# Altium schematic sheet CH32H417MEU6-R0.SchDoc
size 457 x 287 mm; SheetNumber: 0; SheetTotal: 0
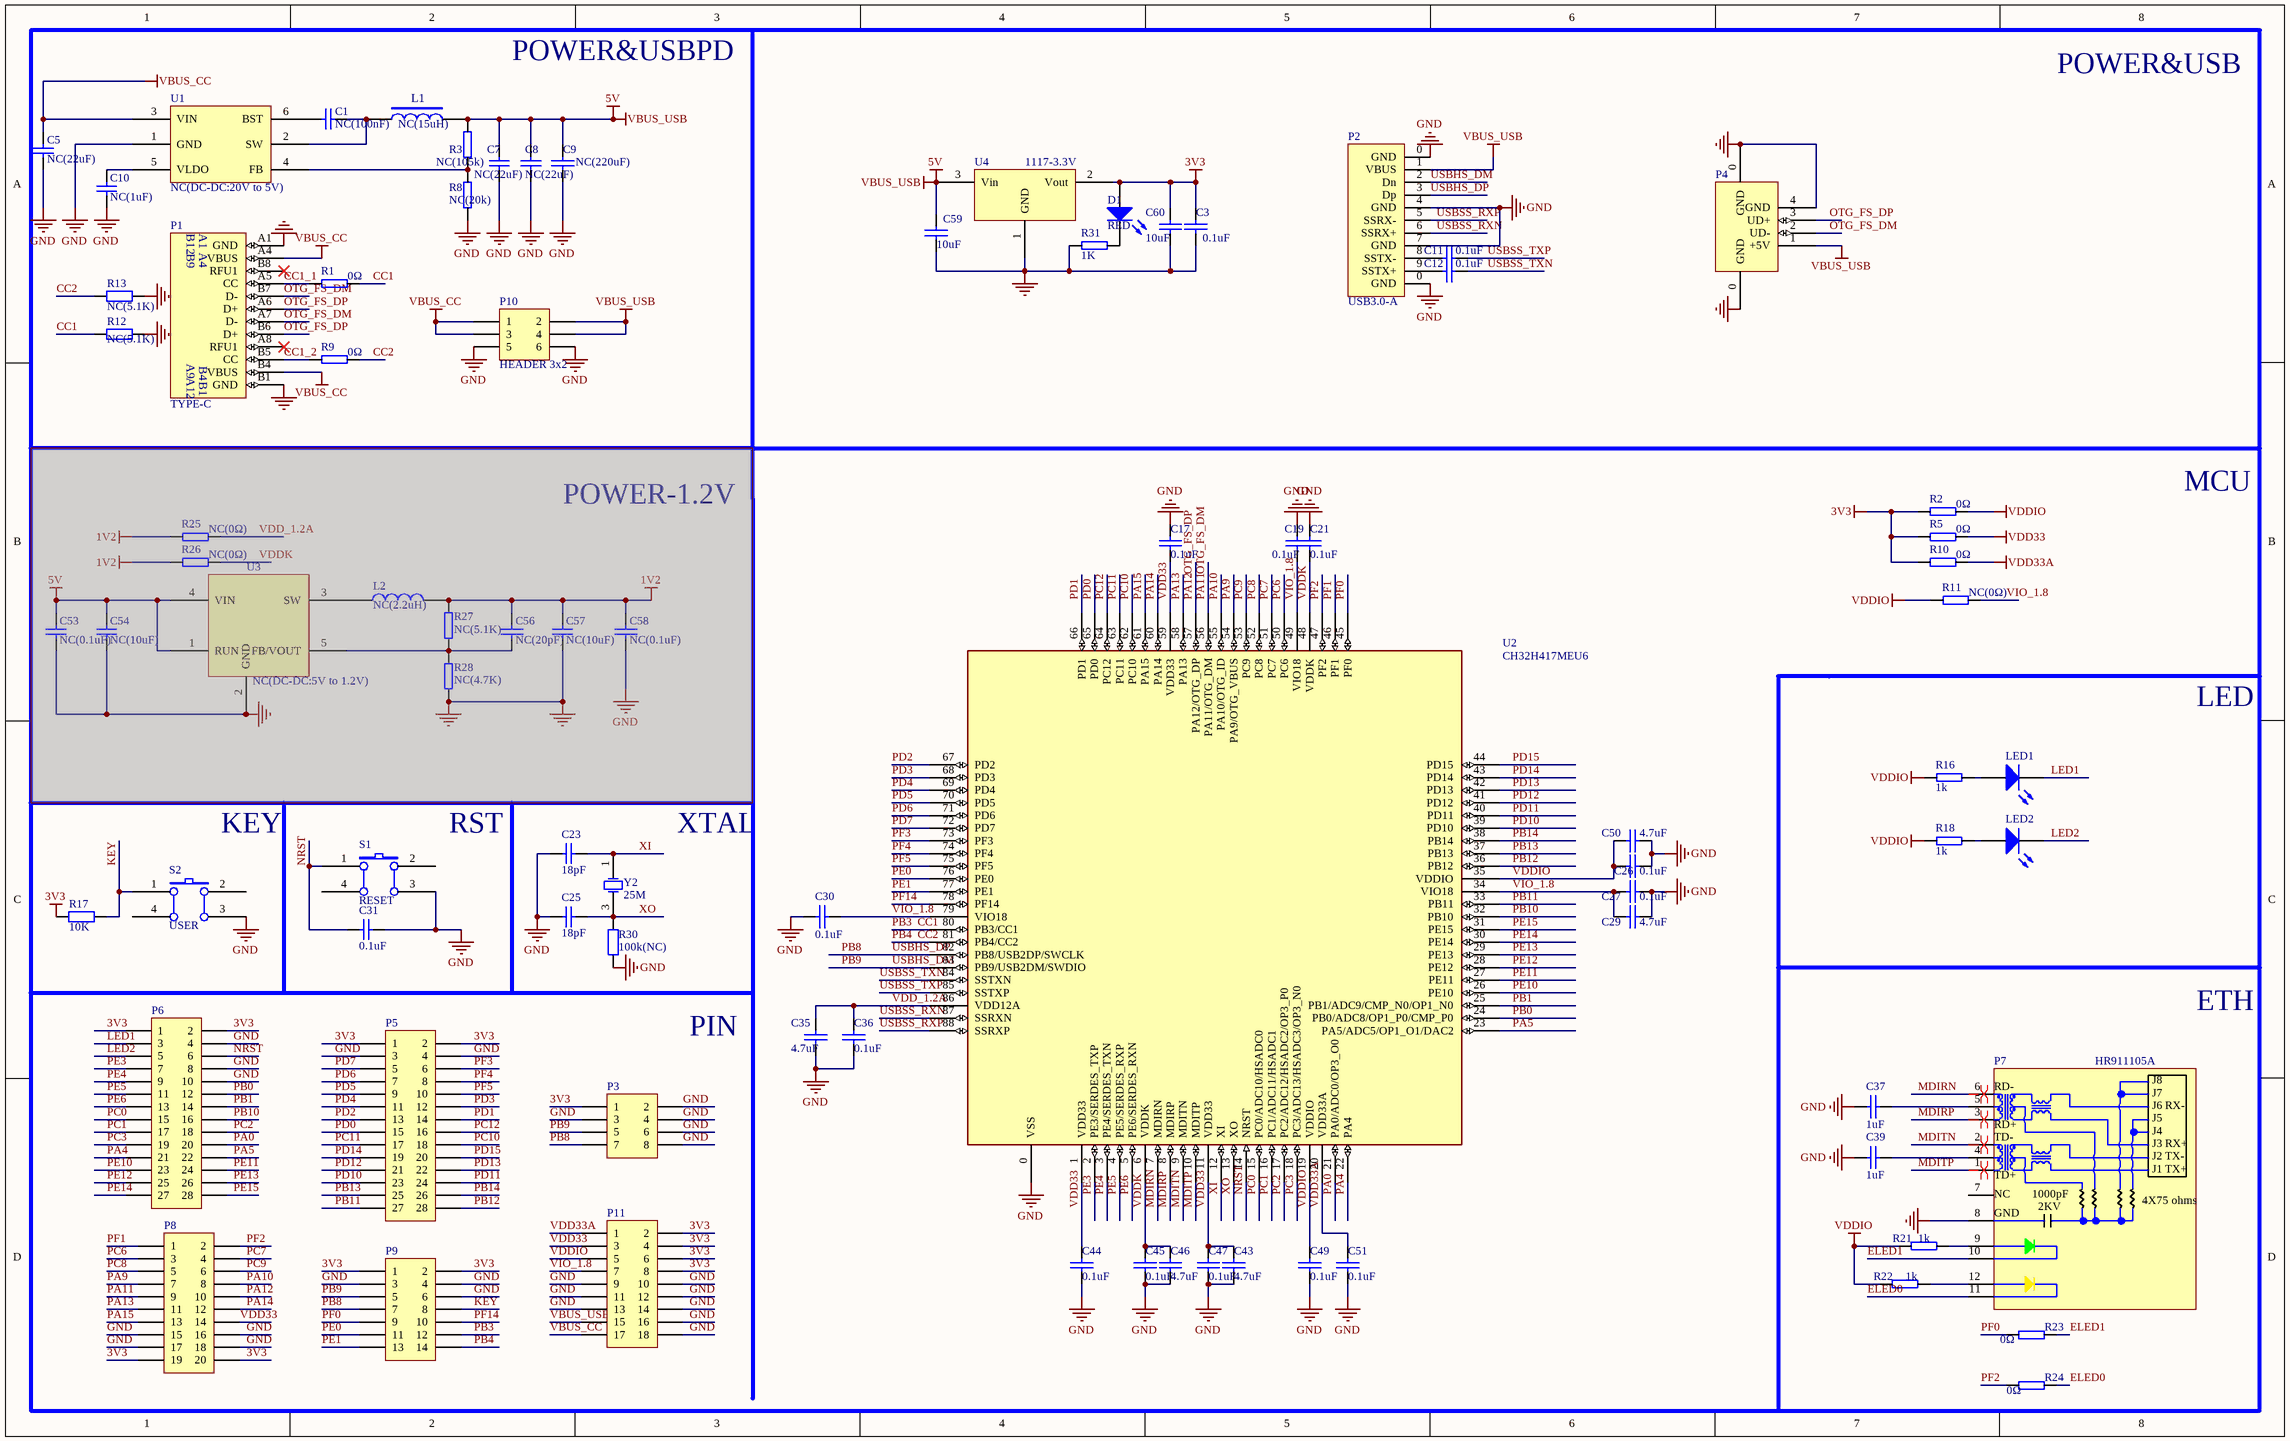
[diagram p0: CH32H417MEU6-R0.SchDoc]

## Parts
C1  NC(100nF)  [0402_C]
C3  0.1uF  [0402_C]
C5  NC(22uF)  [0805_C]
C7  NC(22uF)  [0805_C]
C8  NC(22uF)  [0805_C]
C9  NC(220uF)  [CD0.1]
C10  NC(1uF)  [0402_C]
C11  0.1uF  [0402_C]
C12  0.1uF  [0402_C]
C17  0.1uF  [0402_C]
C19  0.1uF  [0402_C]
C21  0.1uF  [0402_C]
C23  18pF  [0402_C]
C25  18pF  [0402_C]
C26  0.1uF  [0402_C]
C27  0.1uF  [0402_C]
C29  4.7uF  [0402_C]
C30  0.1uF  [0402_C]
C31  0.1uF  [0402_C]
C35  4.7uF  [0402_C]
C36  0.1uF  [0402_C]
C37  1uF  [0402_C]
C39  1uF  [0402_C]
C43  4.7uF  [0402_C]
C44  0.1uF  [0402_C]
C45  0.1uF  [0402_C]
C46  4.7uF  [0402_C]
C47  0.1uF  [0402_C]
C49  0.1uF  [0402_C]
C50  4.7uF  [0402_C]
C51  0.1uF  [0402_C]
C53  NC(0.1uF)  [0402_C]  (masked out: inside a compile mask, not in the netlist)
C54  NC(10uF)  [0603_C]  (masked out: inside a compile mask, not in the netlist)
C56  NC(20pF)  [0402_C]  (masked out: inside a compile mask, not in the netlist)
C57  NC(10uF)  [0603_C]  (masked out: inside a compile mask, not in the netlist)
C58  NC(0.1uF)  [0402_C]  (masked out: inside a compile mask, not in the netlist)
C59  10uF  [0603_C]
C60  10uF  [0603_C]
D1  RED  [0603+]
L1  NC(15uH)  [SMD_6x6mm]
L2  NC(2.2uH)  [CD32]  (masked out: inside a compile mask, not in the netlist)
LED1  LED2  blue  [0603+]  (value not drawn)
LED2  LED1   blue  [0603+]  (value not drawn)
P1  TYPE-C  [TYPE-C-Receptacle-2.0]
P2  USB3.0-A  [USB3.0-A-Receptacle]
P3  HEADER 4x2  [IDC8-2.54mm]  (value not drawn)
P4  USB_A  [USBAF]  (value not drawn)
P5  HEADER 14x2  [IDC28-2.54MM]  (value not drawn)
P6  HEADER 14x2  [IDC28-2.54MM]  (value not drawn)
P7  HR911105A  [HR911105A]
P8  (no value)  [IDC20-2.54MM]
P9  (no value)  [IDC14-2.54mm]
P10  HEADER 3x2  [IDC6-2.54mm]
P11  HEADER 9x2  [IDC18-2.54MM]  (value not drawn)
R1  0Ω  [0402]
R2  0Ω  [0402]
R3  NC(105k)  [0402]
R5  0Ω  [0402]
R8  NC(20k)  [0402]
R9  0Ω  [0402]
R10  0Ω  [0402]
R11  NC(0Ω)  [0402]
R12  NC(5.1K)  [0402]
R13  NC(5.1K)  [0402]
R16  1k  [0402]
R17  10K  [0402]
R18  1k  [0402]
R21  1k  [0402]
R22  1k  [0402]
R23  0Ω  [0402]
R24  0Ω  [0402]
R25  NC(0Ω)  [0402]  (masked out: inside a compile mask, not in the netlist)
R26  NC(0Ω)  [0402]  (masked out: inside a compile mask, not in the netlist)
R27  NC(5.1K)  [0402]  (masked out: inside a compile mask, not in the netlist)
R28  NC(4.7K)  [0402]  (masked out: inside a compile mask, not in the netlist)
R30  100k(NC)  [0402]
R31  1K  [0402]
S1  RESET  [KEYX]
S2  USER  [KEYX]
U1  NC(DC-DC:20V to 5V)
U2  CH32H417MEU6  [QFN88_10X10]
U3  NC(DC-DC:5V to 1.2V)  (masked out: inside a compile mask, not in the netlist)
U4  1117-3.3V  [SOT-223]
Y2  25M  [XT3225]

## Nets
3V3: C3.1 C60.1 D1.1(A) P3.1 P5.1 P5.2 P6.1 P6.2 P8.19 P8.20 P9.1 P9.2 P11.2 P11.4 P11.6 P11.8 R2.2 R5.2 R10.2 R17.2 U4.2(Vout)
GND: C3.2 C5.1 C7.1 C8.1 C9.2 C10.1 C17.1 C19.2 C21.2 C23.1 C25.1 C26.2 C27.2 C29.2 C30.1 C31.1 C35.1 C36.1 C37.1 C39.1 C43.2 C44.1 C45.1 C46.2 C47.2 C49.1 C50.2 C51.1 C59.2 C60.2 P1.A1(GND) P1.B1(GND) P2.0(GND) P2.4(GND) P2.7(GND) P3.2 P3.3 P3.4 P3.6 P3.8 P4.0(GND) P4.4(GND) P5.3 P5.4 P6.4 P6.8 P6.10 P7.8 P8.15 P8.16 P8.17 P8.18 P9.3 P9.4 P9.6 P10.5 P10.6 P11.9 P11.10 P11.11 P11.12 P11.13 P11.14 P11.16 P11.18 R8.1 R12.2 R13.2 R30.1 R31.1 S1.3(B1) S2.3(B1) U1.1(GND) U2.0(VSS) U4.1(GND)
VBUS_CC: C5.2 P1.A4(VBUS) P1.B4(VBUS) P10.1 P10.3 P11.17 U1.3(VIN)
VBUS_USB: C7.2 C8.2 C9.1 C59.1 L1.2 P2.1(VBUS) P4.1(+5V) P10.2 P10.4 P11.15 R3.2 U4.3(Vin)  [also labelled 5V]
VDD33: C17.2 C43.1 C44.2 C47.1 P8.14 P11.3 R5.1 U2.1(VDD33) U2.11(VDD33) U2.59(VDD33)
VDD33A: C51.2 P11.1 R10.1 U2.20(VDD33A)
VDDIO: C26.1 C49.2 C50.1 P11.5 R2.1 R11.2 R16.1 R18.1 R21.1 R22.1 U2.19(VDDIO) U2.35(VDDIO)
CC1: P9.12 R1.1 R12.1 U2.80(PB3/CC1)  [also labelled PB3]
CC1_1: P1.A5(CC) R1.2
CC1_2: P1.B5(CC) R9.2
CC2: P9.14 R9.1 R13.1 U2.81(PB4/CC2)  [also labelled PB4]
ELED0: P7.11 R24.2
ELED1: P7.10 R23.2
KEY: P9.8 R17.1 S2.1(A0)
LED1: LED1.2(K) P6.3
LED2: LED2.2(K) P6.5
MDIRN: P7.6 U2.7(MDIRN)
MDIRP: P7.3 U2.8(MDIRP)
MDITN: P7.2 U2.9(MDITN)
MDITP: P7.1 U2.10(MDITP)
NRST: C31.2 P6.6 S1.1(A0) U2.14(NRST)
OTG_FS_DM: P1.A7(D-) P1.B7(D-) P4.2(UD-) P8.9 U2.56(PA11/OTG_DM)  [also labelled PA11]
OTG_FS_DP: P1.A6(D+) P1.B6(D+) P4.3(UD+) P8.10 U2.57(PA12/OTG_DP)  [also labelled PA12]
PA0: P6.20 U2.21(PA0/ADC0/OP3_O0)
PA4: P6.21 U2.22(PA4)
PA5: P6.22 U2.23(PA5/ADC5/OP1_O1/DAC2)
PA9: P8.7 U2.54(PA9/OTG_VBUS)
PA10: P8.8 U2.55(PA10/OTG_ID)
PA13: P8.11 U2.58(PA13)
PA14: P8.12 U2.60(PA14)
PA15: P8.13 U2.61(PA15)
PB0: P6.12 U2.24(PB0/ADC8/OP1_P0/CMP_P0)
PB1: P6.14 U2.25(PB1/ADC9/CMP_N0/OP1_N0)
PB8: P2.3(Dp) P3.7 P9.7 U2.82(PB8/USB2DP/SWCLK)  [also labelled USBHS_DP]
PB9: P2.2(Dn) P3.5 P9.5 U2.83(PB9/USB2DM/SWDIO)  [also labelled USBHS_DM]
PB10: P6.16 U2.32(PB10)
PB11: P5.27 U2.33(PB11)
PB12: P5.28 U2.36(PB12)
PB13: P5.25 U2.37(PB13)
PB14: P5.26 U2.38(PB14)
PC0: P6.15 U2.15(PC0/ADC10/HSADC0)
PC1: P6.17 U2.16(PC1/ADC11/HSADC1)
PC2: P6.18 U2.17(PC2/ADC12/HSADC2/OP3_P0)
PC3: P6.19 U2.18(PC3/ADC13/HSADC3/OP3_N0)
PC6: P8.3 U2.50(PC6)
PC7: P8.4 U2.51(PC7)
PC8: P8.5 U2.52(PC8)
PC9: P8.6 U2.53(PC9)
PC10: P5.18 U2.62(PC10)
PC11: P5.17 U2.63(PC11)
PC12: P5.16 U2.64(PC12)
PD0: P5.15 U2.65(PD0)
PD1: P5.14 U2.66(PD1)
PD2: P5.13 U2.67(PD2)
PD3: P5.12 U2.68(PD3)
PD4: P5.11 U2.69(PD4)
PD5: P5.9 U2.70(PD5)
PD6: P5.7 U2.71(PD6)
PD7: P5.5 U2.72(PD7)
PD10: P5.23 U2.39(PD10)
PD11: P5.24 U2.40(PD11)
PD12: P5.21 U2.41(PD12)
PD13: P5.22 U2.42(PD13)
PD14: P5.19 U2.43(PD14)
PD15: P5.20 U2.44(PD15)
PE0: P9.11 U2.76(PE0)
PE1: P9.13 U2.77(PE1)
PE3: P6.7 U2.2(PE3/SERDES_TXP)
PE4: P6.9 U2.3(PE4/SERDES_TXN)
PE5: P6.11 U2.4(PE5/SERDES_RXP)
PE6: P6.13 U2.5(PE6/SERDES_RXN)
PE10: P6.23 U2.26(PE10)
PE11: P6.24 U2.27(PE11)
PE12: P6.25 U2.28(PE12)
PE13: P6.26 U2.29(PE13)
PE14: P6.27 U2.30(PE14)
PE15: P6.28 U2.31(PE15)
PF0: P9.9 R23.1 U2.45(PF0)
PF1: P8.1 U2.46(PF1)
PF2: P8.2 R24.1 U2.47(PF2)
PF3: P5.6 U2.73(PF3)
PF4: P5.8 U2.74(PF4)
PF5: P5.10 U2.75(PF5)
PF14: P9.10 U2.78(PF14)
USBSS_RXN: P2.6(SSRX+) U2.87(SSRXN)
USBSS_RXP: P2.5(SSRX-) U2.88(SSRXP)
USBSS_TXN: C12.2 U2.84(SSTXN)
USBSS_TXP: C11.2 U2.85(SSTXP)
VDD_1.2A: C35.2 C36.2 U2.86(VDD12A)
VDDK: C21.1 C45.2 C46.1 U2.6(VDDK) U2.48(VDDK)
VIO_1.8: C19.1 C27.1 C29.1 C30.2 P11.7 R11.1 U2.34(VIO18) U2.49(VIO18) U2.79(VIO18)
XI: C23.2 U2.12(XI) Y2.1(OSC1)
XO: C25.2 R30.2 U2.13(XO) Y2.3(OSC2)
NetC1_1: C1.1 L1.1 U1.2(SW)
NetC1_2: C1.2 U1.6(BST)
NetC10_2: C10.2 U1.5(VLDO)
NetC11_1: C11.1 P2.8(SSTX-)
NetC12_1: C12.1 P2.9(SSTX+)
NetC37_2: C37.2 P7.5
NetC39_2: C39.2 P7.4
NetD1_2: D1.2(K) R31.2
NetLED1_1: LED1.1(A) R16.2
NetLED2_1: LED2.1(A) R18.2
NetP7_9: P7.9 R21.2
NetP7_12: P7.12 R22.2
NetR3_1: R3.1 R8.2 U1.4(FB)

Not connected (* = marked no-connect by the designer): P1 A8(RFU1)* B8(RFU1)*; P7 7; S1 2(B0) 4(A1); S2 2(B0) 4(A1)

## Layout directives
differential pair: MDIRN, MDIRP, MDITN, MDITP

## Notes on the sheet
- POWER&USBPD
- POWER&USB
- POWER-1.2V
- MCU
- (near U3) Hot!!!
- LED
- KEY
- RST
- XTAL
- ETH
- PIN
- Title
- Size:
- Date:
- A3
- Number:
- Time:
- Revision:
- Sheet
- of
- File:
- (in symbol HR911105A) J8; RD-; J7; J6; RX-; J5; RD+; J4; TD-; J3; RX+; J2; TX-; J1; TX+; TD+; NC; 1000pF; 4X75 ohms; 2KV; GND
- (in symbol TYPE-C1) B12; B9; A9; A12

## Library data of the parts
C1 C5 C7 C8 C10 = 0603 100nF (104) 10% 50V: 贴片电容; ComponentLink1Description: 供应商链接; ComponentLink1URL: http://www.szlcsc.com/product/details_15331.html; Package: 0603; Supplier: LC; SuppliersPartNumber: C14663
C3 C9 C11 C12 C17 C19 C21 C26 C27 C29 C30 C35-C37 C39 C43-C47 C49-C51 C56 C58-C60 = CAP: Capacitor
C23 C25 C31 C53 C54 C57 = Cap: Capacitor
  C53 C54 C57: Published: 8-Jun-2000; LatestRevisionDate: 17-Jul-2002; LatestRevisionNote: Re-released for DXP Platform.; PackageReference: RAD-0.3; Publisher: Altium Limited; PackageDescription: Radial Cap, Thru-Hole; 2 Leads; 0.3 in Pin Spacing
D1 LED1 LED2 = LED0: Typical INFRARED GaAs LED; Published: 8-Jun-2000; LatestRevisionDate: 08-Jul-2005; LatestRevisionNote: Mech Layer 1 removed.; PackageReference: LED-0; Publisher: Altium Limited
  D1: PackageDescription: LED; 2 Leads
L1 L2 = INDUCTOR
P1 = TYPE-C1
P3 = HEADER 4x2: Header, 4-Pin, Dual row
P4 = USB: USB Port
P5 P6 = HEADER 14x2: Header, 14-Pin, Dual row
P8 = HEADER 10x2: Header, 10-Pin, Dual row
P9 = HEADER 7x2: Header, 7-Pin, Dual row
P10 = HEADER 3x2: Header, 3-Pin, Dual row
P11 = HEADER 9x2: Header, 9-Pin, Dual row
R1-R3 R5 R8-R11 R16 R18 R21-R26 R31 = RES
R12 R13 R17 R30 = Res2: Resistor
R27 R28 = R
S1 S2 = SW PUSHBUTTON: SE PUSHBUTTON
U1 = TPS54202: DCDC
U2 = CH32H417MEU6: RISC-V FPU HD-MCU, 384MHz, USB3.0 & PD, 100M Ethernet, DVP, QSPI, OPA, ADC, DAC
U3 = FP6160
Y2 = XTAL: Crystal Oscillator; Published: 8-Jun-2000; LatestRevisionDate: 17-Jul-2002; LatestRevisionNote: Re-released for DXP Platform.; PackageReference: R38; Publisher: Altium Limited